# Altium schematic sheet HEALA.SchDoc
size 594 x 420 mm; SheetNumber: 1; SheetTotal: 1; Project: HEALA
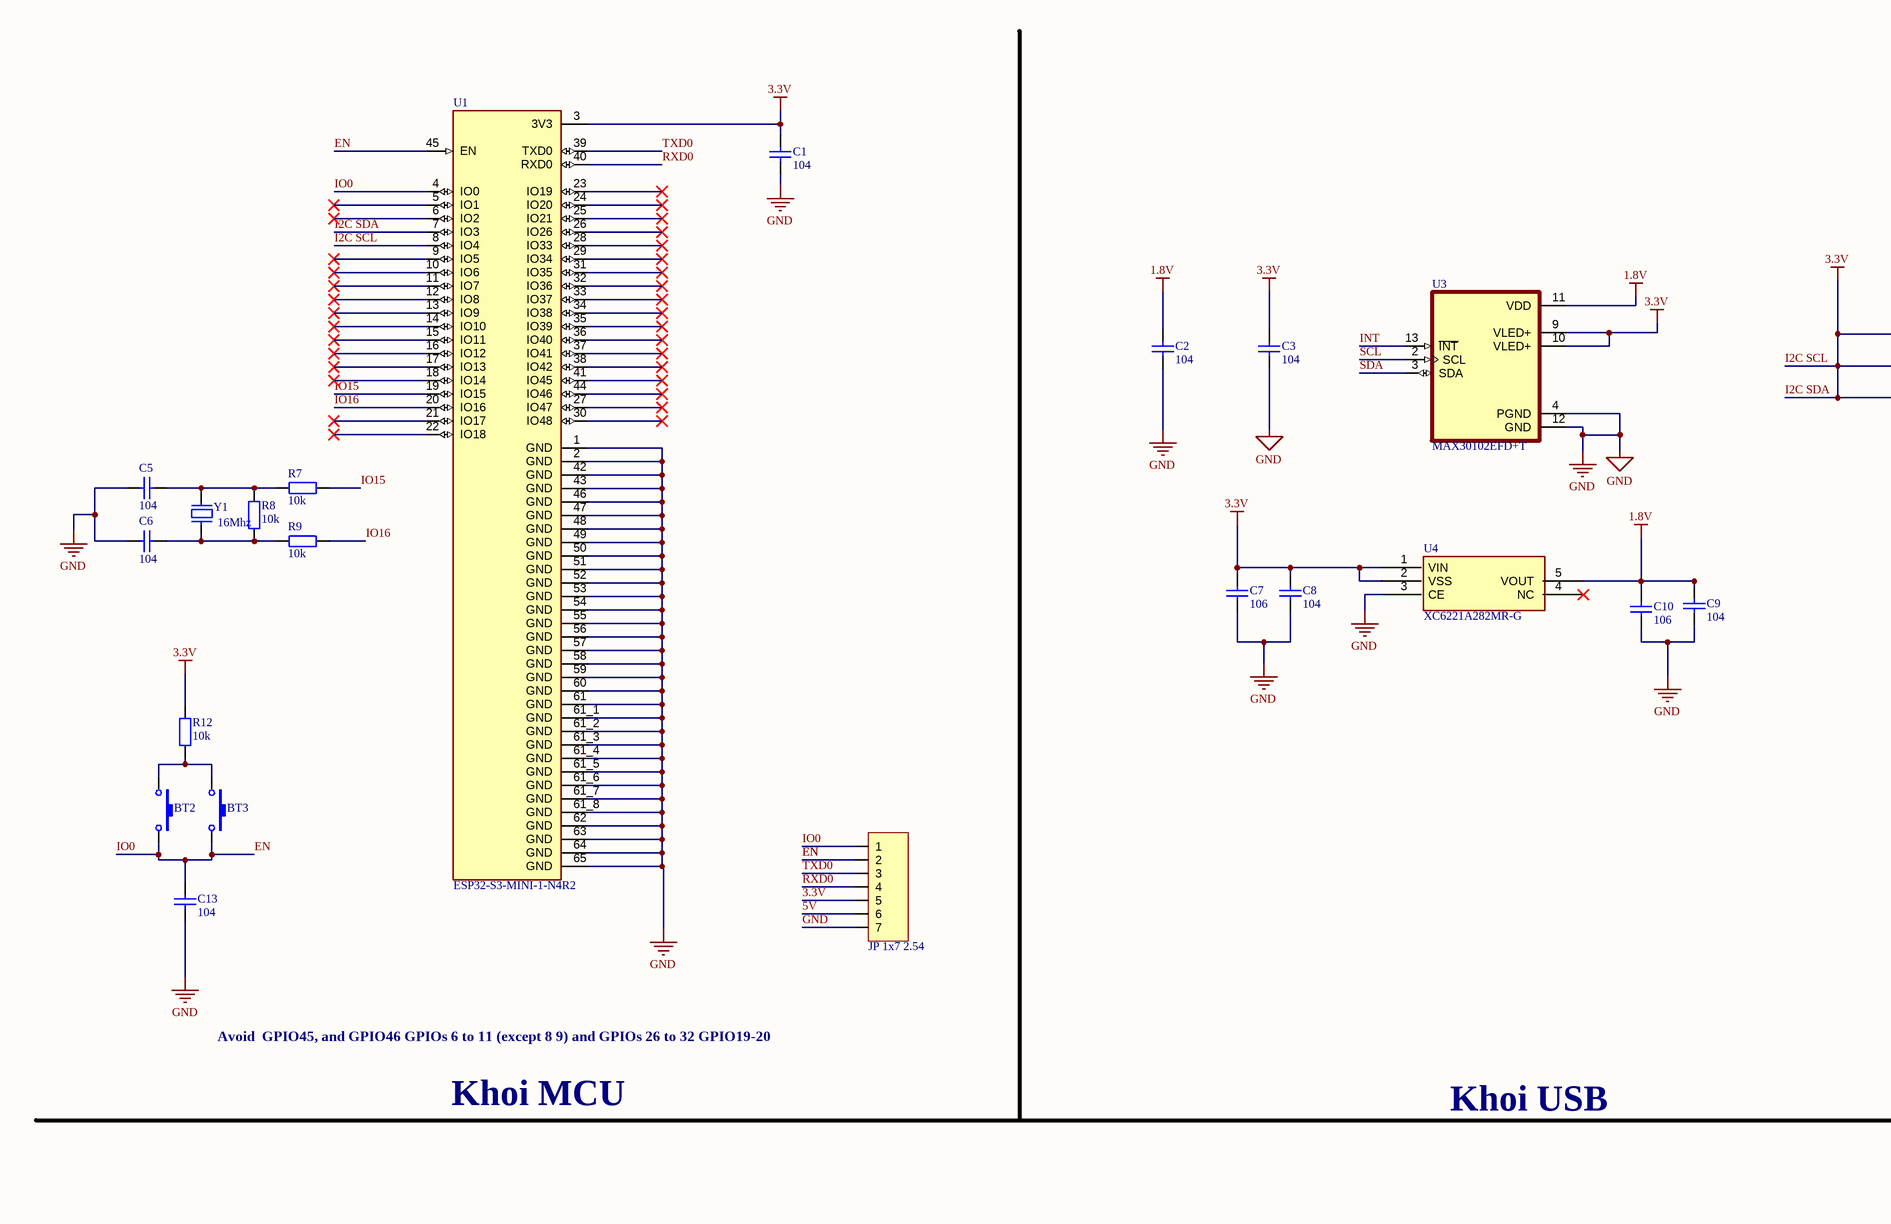
[diagram p0: HEALA.SchDoc, left]
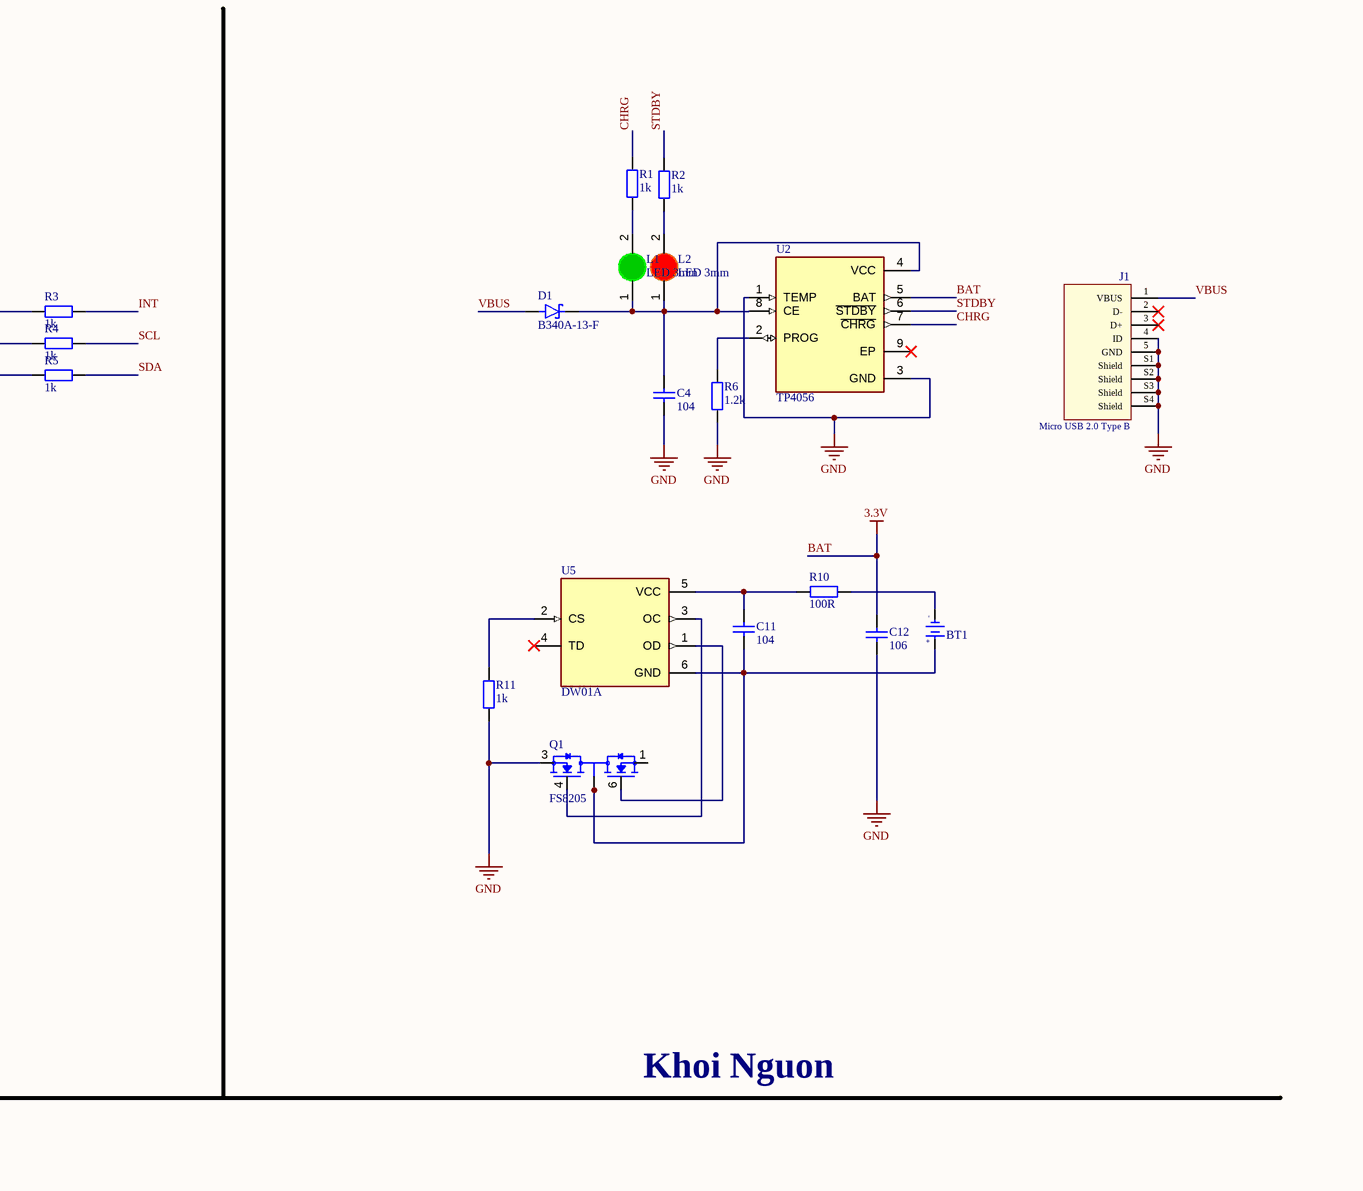
[diagram p1: HEALA.SchDoc, right]

## Parts
BT1  NI-MH 3.6V 20mAh 3/V20H  [PIN 3.6V 20mAh 3/V20H]  (value not drawn)
BT2  Nut Nhan 2 Chan SMD 3x6x2.5  [Nut Nhan 2 Chan SMD 3x6x2.5]  (value not drawn)
BT3  Nut Nhan 2 Chan SMD 3x6x2.5  [Nut Nhan 2 Chan SMD 3x6x2.5]  (value not drawn)
C1  104  [tu 1206]
C2  104  [tu 1206]
C3  104  [tu 1206]
C4  104  [tu 0805]
C5  104  [tu 1206]
C6  104  [tu 1206]
C7  106  [tu 1206]
C8  104  [tu 1206]
C9  104  [tu 1206]
C10  106  [tu 1206]
C11  104  [tu 1206]
C12  106  [tu 1206]
C13  104  [tu 1206]
D1  B340A-13-F  [DIOM5226X240N]
J1  Micro USB 2.0 Type B  [629105136821]
JP1  JP 1x7 2.54  [JP 1x7 CT]
L1  LED 3mm  [LED-3MM-GREEN]
L2  LED 3mm  [LED-3MM-RED]
Q1  FS8205  [SOT95P280X145-6N]
R1  1k  [tro smd 0603]
R2  1k  [tro smd 0603]
R3  1k  [tro smd 1206]
R4  1k  [tro smd 1206]
R5  1k  [tro smd 1206]
R6  1.2k  [tro smd 1206]
R7  10k  [tro smd 1206]
R8  10k  [tro smd 1206]
R9  10k  [tro smd 1206]
R10  100R  [tro smd 1206]
R11  1k  [tro smd 1206]
R12  10k  [tro smd 1206]
U1  ESP32-S3-MINI-1-N4R2  [XCVR_ESP32-S3-MINI-1-N4R2]
U2  TP4056  [SOP127P600X175-9N]
U3  MAX30102EFD+T  [XDCR_MAX30101EFD+]
U4  XC6221A282MR-G  [SOT95P280X120-5N]
U5  DW01A  [SOT95P280X145-6N]
Y1  16Mhz  [Thach Anh 2 Chan 32,768 KHz]

## Nets
1.8V: C2.1 U3.11(VDD)
3.3V: C1.1 C3.1 C7.1 C8.1 C12.1 JP1.5 R3.1 R4.1 R5.1 R12.2 U1.3(3V3) U1.7(IO3) U1.8(IO4) U2.5(BAT) U3.9(VLED+) U3.10(VLED+) U4.1(VIN) U4.2(VSS)  [also labelled BAT, I2C SCL, I2C SDA]
GND: C1.2 C2.2 C3.2 C4.2 C5.2 C6.2 C7.2 C8.2 C9.2 C10.2 C12.2 C13.2 J1.4(ID) J1.5(GND) J1.S1(Shield) J1.S2(Shield) J1.S3(Shield) J1.S4(Shield) JP1.7 Q1.3(S2) R6.1 R11.1 U1.1(GND) U1.2(GND) U1.42(GND) U1.43(GND) U1.46(GND) U1.47(GND) U1.48(GND) U1.49(GND) U1.50(GND) U1.51(GND) U1.52(GND) U1.53(GND) U1.54(GND) U1.55(GND) U1.56(GND) U1.57(GND) U1.58(GND) U1.59(GND) U1.60(GND) U1.61(GND) U1.61_1(GND) U1.61_2(GND) U1.61_3(GND) U1.61_4(GND) U1.61_5(GND) U1.61_6(GND) U1.61_7(GND) U1.61_8(GND) U1.62(GND) U1.63(GND) U1.64(GND) U1.65(GND) U2.1(TEMP) U2.3(GND) U3.4(PGND) U3.12(GND) U4.3(CE)
5V: JP1.6
CHRG: R1.2 U2.7(~{CHRG})
EN: BT2.2 BT3.2 C13.1 JP1.1 JP1.2 U1.4(IO0) U1.45(EN)  [also labelled IO0]
INT: R3.2 U3.13(~{INT})
IO15: R7.2 U1.19(IO15)
IO16: R9.2 U1.20(IO16)
RXD0: JP1.4 U1.40(RXD0)
SCL: R4.2 U3.2(SCL)
SDA: R5.2 U3.3(SDA)
STDBY: R2.2 U2.6(~{STDBY})
TXD0: JP1.3 U1.39(TXD0)
VBUS: D1.A J1.1(VBUS)
NetBT1_1: BT1.1(+3V) C11.2 Q1.2(D12) Q1.5(D12) U5.6(GND)
NetBT1_2: BT1.2(GND) R10.2
NetBT2_1: BT2.1 BT3.1 R12.1
NetC4_1: C4.1 D1.C L1.1(A) L2.1(A) U2.4(VCC) U2.8(CE)
NetC5_1: C5.1 R7.1 R8.2 Y1.2
NetC6_1: C6.1 R8.1 R9.1 Y1.1
NetC9_1: C9.1 C10.1 U4.5(VOUT)
NetC11_1: C11.1 R10.1 U5.5(VCC)
NetL1_2: L1.2(K) R1.1
NetL2_2: L2.2(K) R2.1
NetQ1_4: Q1.4(G2) U5.3(OC)
NetQ1_6: Q1.6(G1) U5.1(OD)
NetR6_2: R6.2 U2.2(PROG)
NetR11_2: R11.2 U5.2(CS)

Not connected (* = marked no-connect by the designer): J1 2(D-)* 3(D+)*; Q1 1(S1); U1 5(IO1)* 6(IO2)* 9(IO5)* 10(IO6)* 11(IO7)* 12(IO8)* 13(IO9)* 14(IO10)* 15(IO11)* 16(IO12)* 17(IO13)* 18(IO14)* 21(IO17)* 22(IO18)* 23(IO19)* 24(IO20)* 25(IO21)* 26(IO26)* 27(IO47)* 28(IO33)* 29(IO34)* 30(IO48)* 31(IO35)* 32(IO36)* 33(IO37)* 34(IO38)* 35(IO39)* 36(IO40)* 37(IO41)* 38(IO42)* 41(IO45)* 44(IO46)*; U2 9(EP)*; U4 4(NC)*; U5 4(TD)*

## Notes on the sheet
- Avoid  GPIO45, and GPIO46 GPIOs 6 to 11 (except 8 9) and GPIOs 26 to 32 GPIO19-20
- Khoi MCU
- Khoi USB
- Khoi Nguon
- DWG NO:
- REV:
- THIS DOCUMENT AND THE DATA DISCLOSED HEREIN OR
- HEREWITH IS THE PROPERTY OF ALTIUM LIMITED AND MAY
- BE FREELY DISTRIBUTED IN WHOLE. NO RIGHTS ARE
- RESERVED OR EXPRESS OR IMPLIED WARANTEE GIVEN.
- REVISION
- DESCRIPTION
- DATE
- APPROVED
- ENG:
- APPROVALS
- PROJECT
- DSN:
- CHK:
- REFERENCE DOCUMENTS
- PROJECT REVISION:
- TITLE
- DOCUMENT REVISION:
- DESIGN ITEM:
- BOM:
- FAB DWG:
- PCB DWG:
- ASSY DWG:
- SCALE:
- A2
- SIZE
- CAGE CODE
- FILE NAME
- DWG NO.
- SHEET
- OF
- REV
- (in symbol PIN 3V) -; +

## Library data of the parts
BT1 = PIN 3V: Battery 3VDC , NI-MH 3.6V 20mAh 3/V20H; Value: PIN 3V
BT2 BT3 = Nut Nhan 2 Chan SMD 3x6x2.5: Ma_Hang: MH001036; Ten: Nút Nhấn 2 Chân 3x6x2.5MM SMD
C1-C3 C5 C6 C8 C9 C11 C13 = Tu 1206 104 50V 20%: Dán; Don_Vi: Con; So_Chan: 2; Ten_Linh_Kien: Tụ 1206 104-0.1uF 20% 50V; Ma_Hang: MH004544; Chung_Loai: Dán; Kieu_Chan: *
C4 = Tu 0805 104 50V 10%: Dán; Don_Vi: Con; So_Chan: 2; Ten_Linh_Kien: Tụ 0805 104-100nF 10% 50V; Ma_Hang: MH004551; Chung_Loai: Dán; Kieu_Chan: *
C7 C10 C12 = Tu 1206 106 16V 20%: Dán; Don_Vi: Con; So_Chan: 2; Ten_Linh_Kien: Tụ 1206 106-10uF 20% 16V; Ma_Hang: MH004541; Chung_Loai: Dán; Kieu_Chan: *
D1 = B340A-13-F: Diode Schottky 40V 3A Surface Mount SMA; MF: Diodes Inc.; Availability: Unavailable; MP: B340A-13-F; Price: None; Value: *; SnapEDA_Link: https://www.snapeda.com/parts/B340A-13-F/Diodes%20Inc./view-part/78704/?ref=snap; Package: DO-214 Diodes Inc.
J1 = 629105136821: Micro USB 2.0 Type B Horizontal SMT 5 Contacts WR-COM; Rated Current: 1 A; Gender: Female; ComponentLink1Description: Manufacturer; ComponentLink1URL: http://www.we-online.de; ComponentLink2Description: Datasheet; ComponentLink2URL: http://katalog.we-online.de/em/datasheet/629105136821.pdf; Part Number: 629105136821; Published Date: May 2018; Publisher: Wurth Elektronik; Orientation: Horizontal; Interface Type: Micro USB 2.0 Type B; Operating Temperature: -40 to 85 degC; Mounting Technology: SMT; Packaging: Tape and Reel
JP1 = JP 1x7 2.54 Cai Thang: Cắm; Ten_Linh_Kien: Jump Đơn Cái 2.54MM 1x20P Thẳng; Don_Vi: Con; Ma_Hang: MH004006; Ghi_Chu: *; Kieu_Chan: *; Chung_Loai: Cắm
L1 = LED 3mm Xanh La: Cắm; Don_Vi: Con; Ma_Hang: MH001054; Ten_Linh_Kien: Led 3MM Phủ Xanh (10c); Ghi_Chu: *; Kieu_Chan: *; Chung_Loai: Cắm
L2 = LED 3mm Do: Cắm; Don_Vi: Con; Ma_Hang: MH003892; Ten_Linh_Kien: Led 3MM Phủ Đỏ (10c); Ghi_Chu: *; Kieu_Chan: *; Chung_Loai: Cắm
Q1 = FS8205: ÐœÐžÐŸ-Ñ‚Ñ€Ð°Ð½Ð·Ð¸ÑÑ‚Ð¾Ñ€ Ñ Ð´Ð²Ð¾Ð¹Ð½Ñ‹Ð¼ N-ÐºÐ°Ð½Ð°Ð»ÑŒÐ½Ñ‹Ð¼ Ñ€ÐµÐ¶Ð¸Ð¼Ð¾Ð¼ ÑƒÑÐ¸Ð»ÐµÐ½Ð¸Ñ Ð¼Ð¾Ñ‰Ð½Ð¾ÑÑ‚Ð¸; MF: Fortune Semiconductor; SnapEDA_Link: https://www.snapeda.com/parts/FS8205/Fortune+Semiconductor/view-part/?ref=snap; Package: Package; Value: *; MP: FS8205; Check_prices: https://www.snapeda.com/parts/FS8205/Fortune+Semiconductor/view-part/?ref=eda
R1 R2 = Tro 0603 1% 1k: Dán; So_Chan: 2; Don_Vi: Con; Ten_Linh_Kien: Trở 0603 1% 1k; Ma_Hang: MH006334; Chung_Loai: Dán; Kieu_Chan: *
R3-R5 R11 = Tro 1206 5% 1k: Dán; Don_Vi: Con; So_Chan: 2; Ten_Linh_Kien: Trở 1206 5% 1k; Ma_Hang: MH005904; Chung_Loai: Dán; Kieu_Chan: *
R6 = Tro 1206 5% 1.2k: Dán; Don_Vi: Con; So_Chan: 2; Ten_Linh_Kien: Trở 1206 5% 1.2K; Ma_Hang: MH008106; Chung_Loai: Dán; Kieu_Chan: *
R7-R9 R12 = Tro 1206 5% 10k: Dán; Don_Vi: Con; So_Chan: 2; Ten_Linh_Kien: Trở 1206 5% 10K; Ma_Hang: MH005909; Chung_Loai: Dán; Kieu_Chan: *
R10 = Tro 1206 1% 100R: Dán; So_Chan: 2; Don_Vi: Con; Ten_Linh_Kien: Trở 1206 1% 100R; Ma_Hang: MH005891; Chung_Loai: Dán; Kieu_Chan: *
U1 = ESP32-S3-MINI-1-N4R2: Bluetooth, WiFi 802.11b/g/n, Bluetooth v5.0 Transceiver Module 2.4GHz PCB Trace Surface Mount; MF: Espressif Systems; SnapEDA_Link: https://www.snapeda.com/parts/ESP32-S3-MINI-1-N4R2/Espressif+Systems/view-part/?ref=snap; Package: None; Value: *; MP: ESP32-S3-MINI-1-N4R2; Check_prices: https://www.snapeda.com/parts/ESP32-S3-MINI-1-N4R2/Espressif+Systems/view-part/?ref=eda
U2 = TP4056: Complete single cell Li-Ion battery with a constant current / constant voltage linear charger; MF: NanJing Top Power ASIC Corp.; Check_prices: https://www.snapeda.com/parts/TP4056/NanJing+Top+Power+ASIC+Corp./view-part/?ref=eda; SnapEDA_Link: https://www.snapeda.com/parts/TP4056/NanJing+Top+Power+ASIC+Corp./view-part/?ref=snap; Price: None; Availability: Not in stock; Package: Package; MP: TP4056; Value: *
U3 = MAX30102EFD+T: Pulse Oximeter and Heart Rate Sensor Digital Output; MF: Maxim Integrated Products; Digi-Key_Part_Number: MAX30102EFD+TTR-ND; Check_prices: https://www.snapeda.com/parts/MAX30102EFD+T/Maxim+Integrated/view-part/?ref=eda; MP: MAX30102EFD+T; Package: None; SnapEDA_Link: https://www.snapeda.com/parts/MAX30102EFD+T/Maxim+Integrated/view-part/?ref=snap; Value: *; Purchase-URL: https://pricing.snapeda.com/search/part/MAX30102EFD+T/?ref=eda
U5 = DW01A: One Cell Lithium-ion/Polymer Battery Protection IC; MF: Fortune Semiconductor; SnapEDA_Link: https://www.snapeda.com/parts/DW01A/Fortune+Semiconductor/view-part/?ref=snap; Package: SOT-23-6 Fortune Semiconductor; Value: *; MP: DW01A; Check_prices: https://www.snapeda.com/parts/DW01A/Fortune+Semiconductor/view-part/?ref=eda
Y1 = Thach Anh 2 chan 32,768 Khz: Crystal For all Crystal 2pin.; Value: 4Mhz